# Altium schematic sheet MODEM.SchDoc
size A2
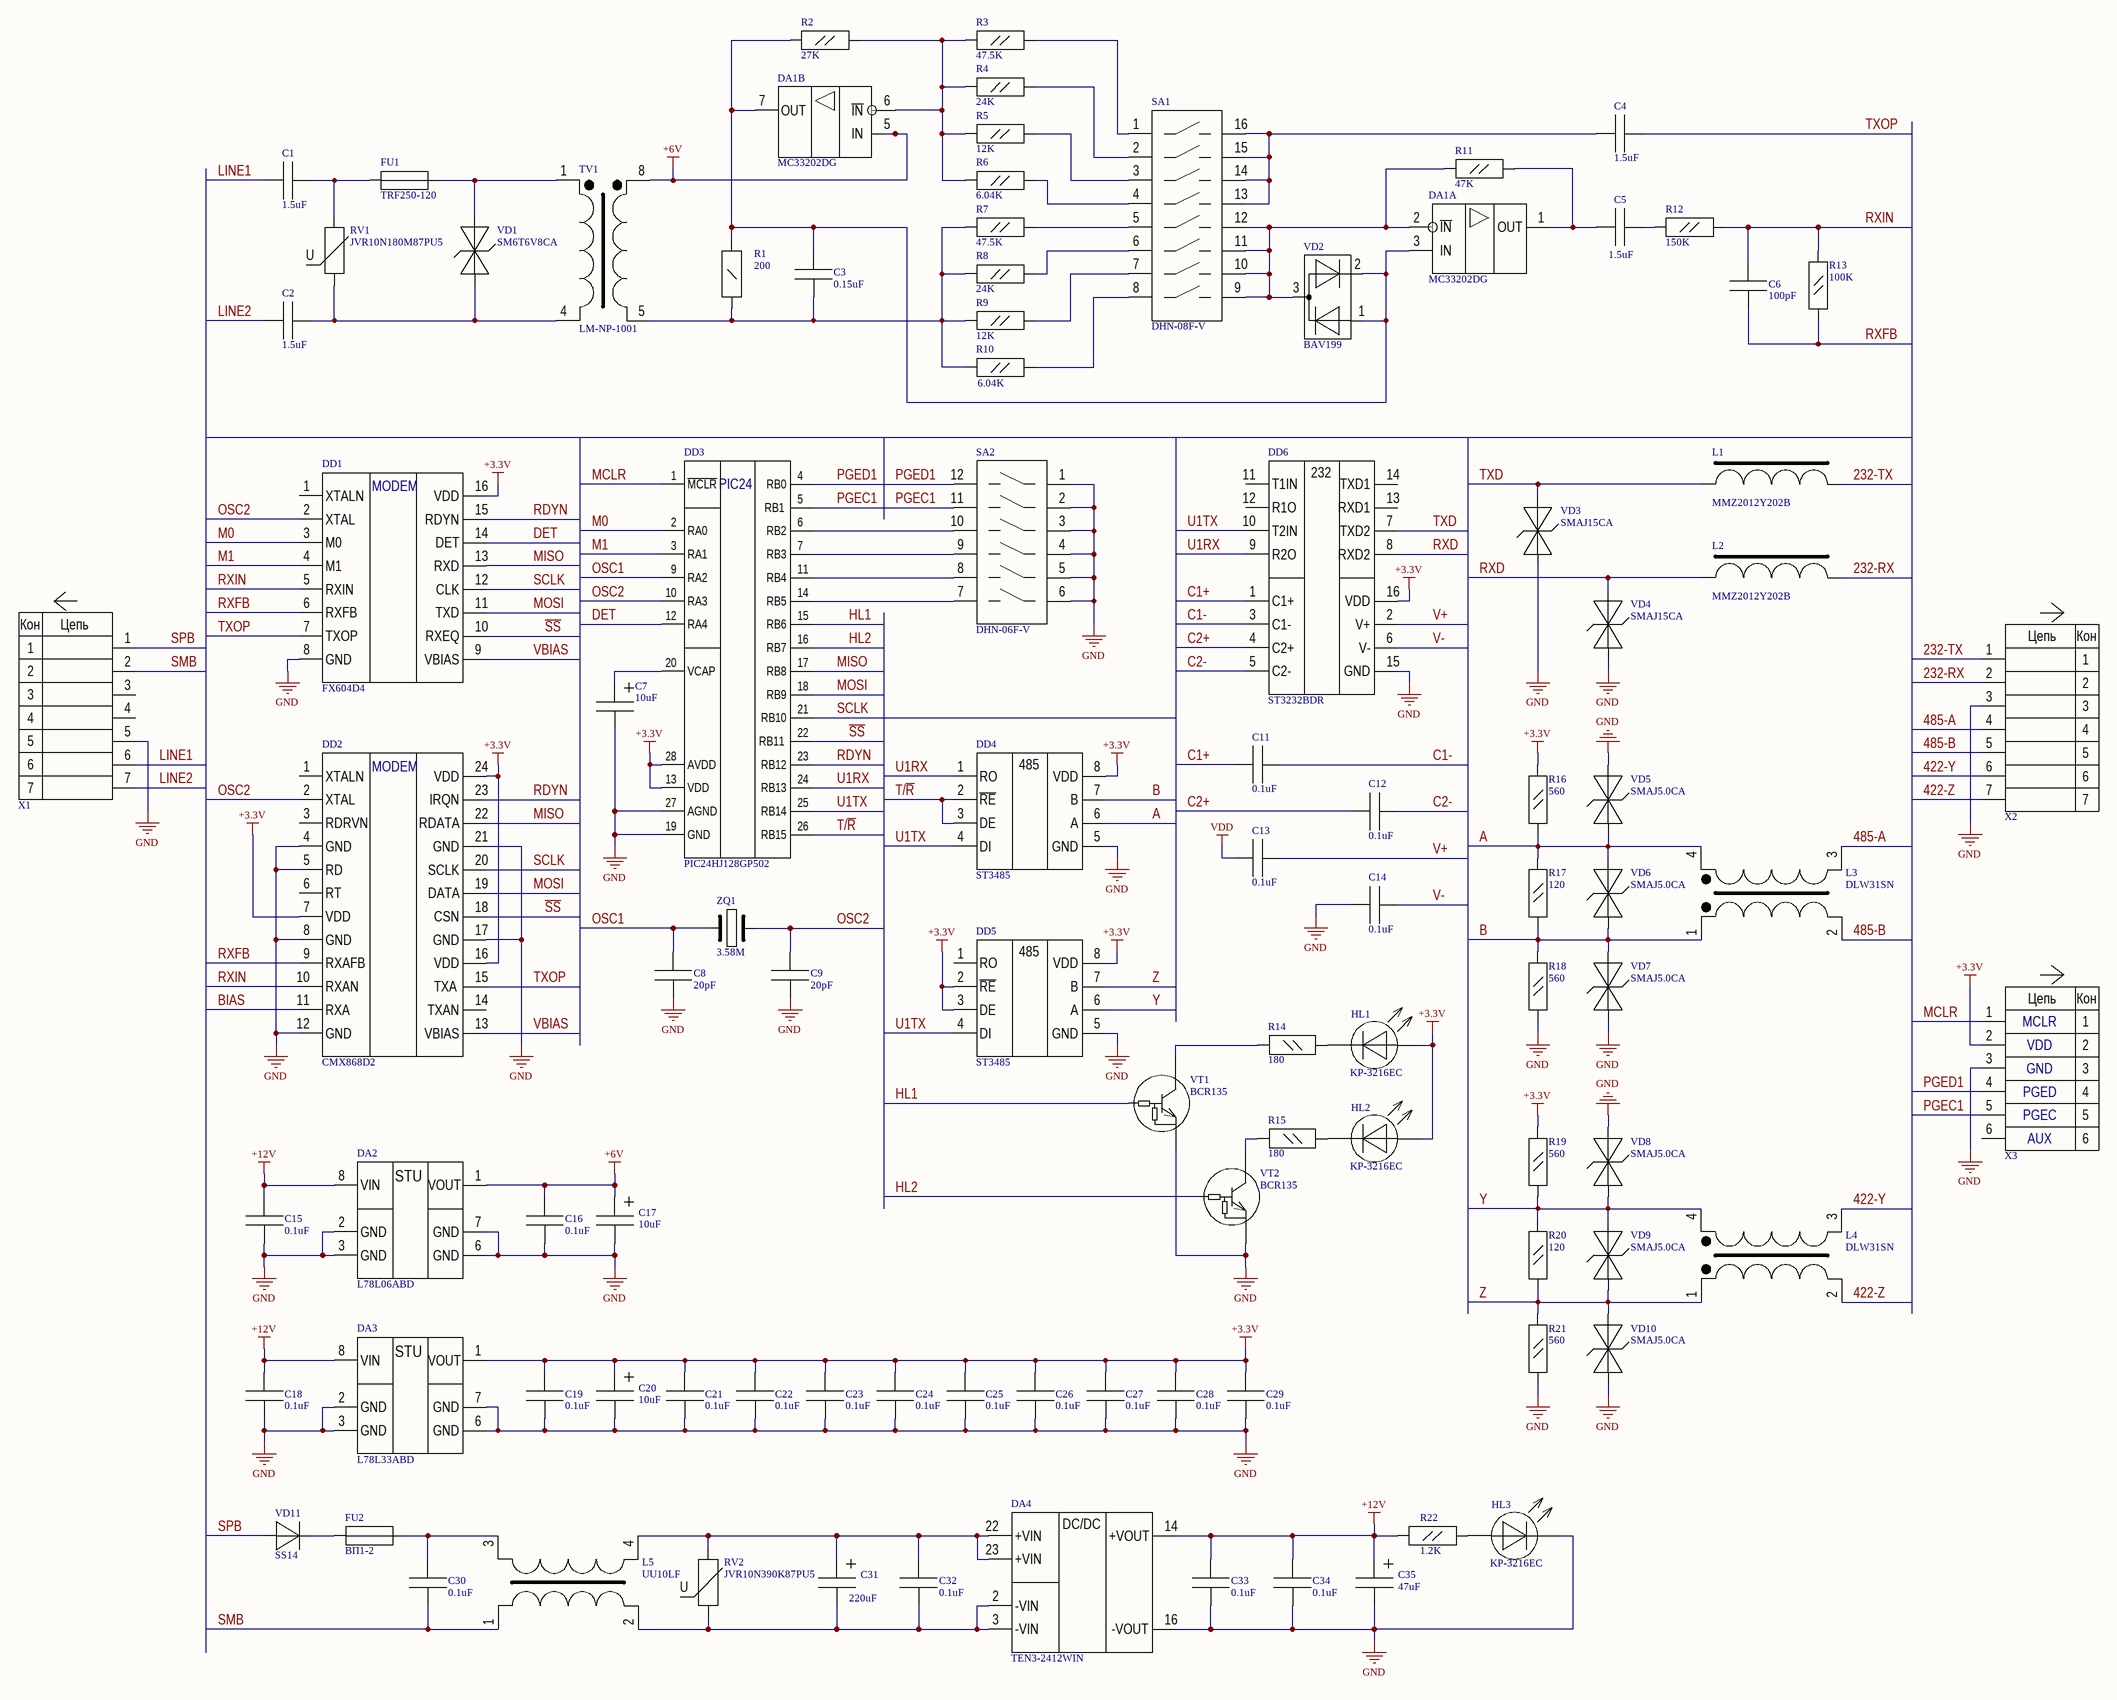
[diagram p0: MODEM.SchDoc]

## Parts
C1  1.5uF  [TS02-22.5]
C2  1.5uF  [TS02-22.5]
C3  0.15uF  [CC0805]
C4  1.5uF  [CC1206]
C5  1.5uF  [CC1206]
C6  100pF  [CC0805]
C7  10uF  [SMB]
C8  20pF  [CC0805]
C9  20pF  [CC0805]
C11  0.1uF  [CC0805]
C12  0.1uF  [CC0805]
C13  0.1uF  [CC0805]
C14  0.1uF  [CC0805]
C15  0.1uF  [CC0805]
C16  0.1uF  [CC0805]
C17  10uF  [SMB]
C18  0.1uF  [CC0805]
C19  0.1uF  [CC0805]
C20  10uF  [SMB]
C21  0.1uF  [CC0805]
C22  0.1uF  [CC0805]
C23  0.1uF  [CC0805]
C24  0.1uF  [CC0805]
C25  0.1uF  [CC0805]
C26  0.1uF  [CC0805]
C27  0.1uF  [CC0805]
C28  0.1uF  [CC0805]
C29  0.1uF  [CC0805]
C30  0.1uF  [CC0805]
C31  220uF  [SH050-1019]
C32  0.1uF  [CC0805]
C33  0.1uF  [CC0805]
C34  0.1uF  [CC0805]
C35  47uF  [SMD]
DA1  MC33202DG  [MC33202DG]  (parts A,B of 2)
DA2  L78L06ABD  [L78L06ABD]
DA3  L78L33ABD  [L78L06ABD]
DA4  TEN3-2412WIN  [TEN3-2412WIN]
DD1  FX604D4  [FX604D4]
DD2  CMX868D2  [CMX868D2]
DD3  PIC24HJ128GP502  [PIC24HJ128GP502]
DD4  ST3485  [SP3485]
DD5  ST3485  [SP3485]
DD6  ST3232BDR  [ST3232BDR]
FU1  TRF250-120  [TRF250-120]
FU2  ВП1-2  [VP1-2]
HL1  KP-3216EC  [KP-3216EC]
HL2  KP-3216EC  [KP-3216EC]
HL3  KP-3216EC  [KP-3216EC]
L1  MMZ2012Y202B  [MMZ2012Y202B]
L2  MMZ2012Y202B  [MMZ2012Y202B]
L3  DLW31SN  [DLW31SN]
L4  DLW31SN  [DLW31SN]
L5  UU10LF  [UU10LF]
R1  200  [RC1206]
R2  27K  [RC0805]
R3  47.5K  [RC0805]
R4  24K  [RC0805]
R5  12K  [RC0805]
R6  6.04K  [RC0805]
R7  47.5K  [RC0805]
R8  24K  [RC0805]
R9  12K  [RC0805]
R10  6.04K  [RC0805]
R11  47K  [RC0805]
R12  150K  [RC0805]
R13  100K  [RC0805]
R14  180  [RC0805]
R15  180  [RC0805]
R16  560  [RC0805]
R17  120  [RC0805]
R18  560  [RC0805]
R19  560  [RC0805]
R20  120  [RC0805]
R21  560  [RC0805]
R22  1.2K  [RC1206]
RV1  JVR10N180M87PU5  [JVR07N330]
RV2  JVR10N390K87PU5  [JVR07N330]
SA1  DHN-08F-V  [DHN-08F-V]
SA2  DHN-06F-V  [DHN-06F-V]
TV1  LM-NP-1001  [LM-NP-1001]
VD1  SM6T6V8CA  [SM6T6V8CA]
VD2  BAV199  [BAV199]
VD3  SMAJ15CA  [SMAJ6.0CA]
VD4  SMAJ15CA  [SMAJ6.0CA]
VD5  SMAJ5.0CA  [SMAJ6.0CA]
VD6  SMAJ5.0CA  [SMAJ6.0CA]
VD7  SMAJ5.0CA  [SMAJ6.0CA]
VD8  SMAJ5.0CA  [SMAJ6.0CA]
VD9  SMAJ5.0CA  [SMAJ6.0CA]
VD10  SMAJ5.0CA  [SMAJ6.0CA]
VD11  SS14  [SS14]
VT1  BCR135  [BCR135]
VT2  BCR135  [BCR135]
X1  8113_S/07  [8113_S/07]  (value not drawn)
X2  8113_S/07  [8113_S/07]  (value not drawn)
X3  PLS-06  [PLS-06]  (value not drawn)
ZQ1  3.58M  [HC-49/S]

## Nets
+3.3V: C19.2 C20.2(A) C21.2 C22.2 C23.2 C24.2 C25.2 C26.2 C27.2 C28.2 C29.2 DA3.1(VOUT) DD1.16(VDD) DD2.7(VDD) DD2.16(VDD) DD2.24(VDD) DD3.13(VDD) DD3.28(AVDD) DD4.8(VDD) DD5.2(~{RE}) DD5.3(DE) DD5.8(VDD) DD6.16(VDD) HL1.1(A) HL2.1(A) R16.1 R19.1 X3.2
+6V: C16.2 C17.2(A) DA1.5(IN) DA2.1(VOUT) TV1.8
+12V: C15.2 C18.2 C33.2 C34.2 C35.2(A) DA1.8(VDD) DA2.8(VIN) DA3.8(VIN) DA4.14(+VOUT) R22.1
GND: C7.1(C) C8.1 C9.1 C14.1 C15.1 C16.1 C17.1(C) C18.1 C19.1 C20.1(C) C21.1 C22.1 C23.1 C24.1 C25.1 C26.1 C27.1 C28.1 C29.1 C33.1 C34.1 C35.1(C) DA1.4(VSS) DA2.2(GND) DA2.3(GND) DA2.6(GND) DA2.7(GND) DA3.2(GND) DA3.3(GND) DA3.6(GND) DA3.7(GND) DA4.16(-VOUT) DD1.8(GND) DD2.4(GND) DD2.5(RD) DD2.8(GND) DD2.12(GND) DD2.17(GND) DD2.21(GND) DD3.19(GND) DD3.27(AGND) DD4.5(GND) DD5.5(GND) DD6.15(GND) HL3.2(С) R18.2 R21.2 SA2.1 SA2.2 SA2.3 SA2.4 SA2.5 SA2.6 VD3.1(A) VD4.1(A) VD5.2(С) VD7.1(A) VD8.2(С) VD10.1(A) VT1.2(E) VT2.2(E) X1.5 X2.3 X3.3
VDD: C13.1
232-RX: L2.2 X2.2
232-TX: L1.2 X2.1
422-Y: L4.3 X2.6
422-Z: L4.2 X2.7
485-A: L3.3 X2.4
485-B: L3.2 X2.5
~{SS}: DD1.10(RXEQ) DD2.18(CSN) DD3.22(RB11)
A: DD4.6(A) L3.4 R16.2 R17.1 VD5.1(A) VD6.2(С)
B: DD4.7(B) L3.1 R17.2 R18.1 VD6.1(A) VD7.2(С)
BIAS: DD2.11(RXA)
C1+: C11.1 DD6.1(C1+)
C1-: C11.2 DD6.3(C1-)
C2+: C12.1 DD6.4(C2+)
C2-: C12.2 DD6.5(C2-)
DET: DD1.14(DET) DD3.12(RA4)
HL1: DD3.15(RB6) VT1.1(B)
HL2: DD3.16(RB7) VT2.1(B)
LINE1: C1.1 X1.6
LINE2: C2.1 X1.7
M0: DD1.3(M0) DD3.2(RA0)
M1: DD1.4(M1) DD3.3(RA1)
MCLR: DD3.1(~{MCLR}) X3.1
MISO: DD1.13(RXD) DD2.22(RDATA) DD3.17(RB8)
MOSI: DD1.11(TXD) DD2.19(DATA) DD3.18(RB9)
OSC1: C8.2 DD3.9(RA2) ZQ1.1
OSC2: C9.2 DD1.2(XTAL) DD2.2(XTAL) DD3.10(RA3) ZQ1.2
PGEC1: DD3.5(RB1) SA2.11 X3.5
PGED1: DD3.4(RB0) SA2.12 X3.4
RDYN: DD1.15(RDYN) DD2.23(IRQN) DD3.23(RB12)
RXD: DD6.8(RXD2) L2.1 VD4.2(С)
RXFB: C6.2 DD1.6(RXFB) DD2.9(RXAFB) R13.2
RXIN: C6.1 DD1.5(RXIN) DD2.10(RXAN) R12.2 R13.1
SCLK: DD1.12(CLK) DD2.20(SCLK) DD3.21(RB10)
SMB: C30.1 L5.1 X1.2
SPB: VD11.1(A) X1.1
T/~{R}: DD3.26(RB15) DD4.2(~{RE}) DD4.3(DE)
TXD: DD6.7(TXD2) L1.1 VD3.2(С)
TXOP: C4.2 DD1.7(TXOP) DD2.15(TXA)
U1RX: DD3.24(RB13) DD4.1(RO) DD6.9(R2O)
U1TX: DD3.25(RB14) DD4.4(DI) DD5.4(DI) DD6.10(T2IN)
V+: C13.2 DD6.2(V+)
V-: C14.2 DD6.6(V-)
VBIAS: DD1.9(VBIAS) DD2.13(VBIAS)
Y: DD5.6(A) L4.4 R19.2 R20.1 VD8.1(A) VD9.2(С)
Z: DD5.7(B) L4.1 R20.2 R21.1 VD9.1(A) VD10.2(С)
NetC1_2: C1.2 FU1.1 RV1.1
NetC2_2: C2.2 RV1.2 TV1.4 VD1.1(A)
NetC3_1: C3.1 R1.2 R7.1 R8.1 R9.1 R10.1 TV1.5
NetC3_2: C3.2 DA1.3(IN) DA1.7(OUT) R1.1 R2.1 VD2.1(A) VD2.2(С)
NetC4_1: C4.1 SA1.13 SA1.14 SA1.15 SA1.16
NetC5_1: C5.1 DA1.1(OUT) R11.2
NetC5_2: C5.2 R12.1
NetC7_2: C7.2(A) DD3.20(VCAP)
NetC30_2: C30.2 FU2.2 L5.3
NetC31_1: C31.1(C) C32.1 DA4.2(-VIN) DA4.3(-VIN) L5.2 RV2.2
NetC31_2: C31.2(A) C32.2 DA4.22(+VIN) DA4.23(+VIN) L5.4 RV2.1
NetDA1_2: DA1.2(~{IN}) R11.1 SA1.9 SA1.10 SA1.11 SA1.12 VD2.3(AC)
NetDA1_6: DA1.6(~{IN}) R2.2 R3.1 R4.1 R5.1 R6.1
NetDD3_6: DD3.6(RB2) SA2.10
NetDD3_7: DD3.7(RB3) SA2.9
NetDD3_11: DD3.11(RB4) SA2.8
NetDD3_14: DD3.14(RB5) SA2.7
NetFU1_2: FU1.2 TV1.1 VD1.2(С)
NetFU2_1: FU2.1 VD11.2(С)
NetHL1_2: HL1.2(С) R14.2
NetHL2_2: HL2.2(С) R15.2
NetHL3_1: HL3.1(A) R22.2
NetR3_2: R3.2 SA1.1
NetR4_2: R4.2 SA1.2
NetR5_2: R5.2 SA1.3
NetR6_2: R6.2 SA1.4
NetR7_2: R7.2 SA1.5
NetR8_2: R8.2 SA1.6
NetR9_2: R9.2 SA1.7
NetR10_2: R10.2 SA1.8
NetR14_1: R14.1 VT1.3(C)
NetR15_1: R15.1 VT2.3(C)

Not connected (* = marked no-connect by the designer): DD1 1(XTALN); DD2 1(XTALN) 3(RDRVN) 6(RT) 14(TXAN); DD5 1(RO); DD6 11(T1IN) 12(R1O) 13(RXD1) 14(TXD1); X1 3 4; X3 6

## Notes on the sheet
- (near X3) MCLR
- (near X3) VDD
- (near X3) GND
- (near X3) PGED
- (near X3) PGEC
- (near X3) AUX
- Title
- Size:
- Date:
- File:
- A2
- Number:
- Time:
- Revision:
- Sheet
- of
- (in symbol 8113_S/07) Цепь; Кон
- (in symbol CMX868D2) MODEM
- (in symbol FX604D4) MODEM
- (in symbol JVR14N361) U
- (in symbol L78L06ABD) STU
- (in symbol L78L33ABD) STU
- (in symbol PIC24HJ128GP502) PIC24
- (in symbol PLS-06) Цепь; Кон
- (in symbol SP3232) 232
- (in symbol SP3485) 485
- (in symbol TEN3-2412WIN) DC/DC

## Library data of the parts
C1-C6 C8 C9 C11-C16 C18 C19 C21-C30 C32-C34 = CC1206
C7 C17 C20 C31 C35 = SR-6
DD4 DD5 = SP3485
DD6 = SP3232
FU2 = VPB6
HL1 HL2 = KP-3216EC_L
HL3 = KP-3216EC_R
L5 = TRANS
R1 = RC1206
R2-R22 = RC0805
RV1 RV2 = JVR14N361
VD3-VD10 = SMAJ6.0CA
ZQ1 = ZQ